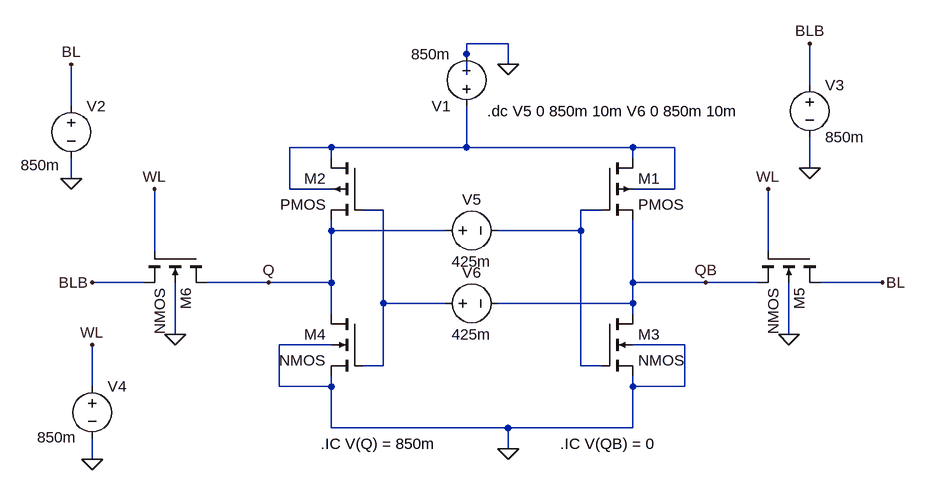
[diagram p0: schematic sram6t_snm.asc]
sram6t_snm.asc, the LTspice schematic file:
Version 4
SHEET 1 1636 4668
WIRE 288 -112 224 -112
WIRE 224 -96 224 -112
WIRE 288 -80 288 -112
WIRE 224 -64 224 -96
WIRE 752 -48 752 -112
WIRE -384 -16 -384 -80
WIRE 16 48 -48 48
WIRE 224 48 224 -16
WIRE 224 48 16 48
WIRE 480 48 224 48
WIRE 544 48 480 48
WIRE 16 64 16 48
WIRE 480 64 480 48
WIRE 752 80 752 32
WIRE -384 96 -384 64
WIRE -48 112 -48 48
WIRE 16 112 -48 112
WIRE 544 112 544 48
WIRE 544 112 480 112
WIRE 96 144 64 144
WIRE 432 144 400 144
WIRE 16 176 16 160
WIRE 192 176 16 176
WIRE 400 176 400 144
WIRE 400 176 272 176
WIRE -256 208 -256 112
WIRE 688 208 688 112
WIRE -272 256 -352 256
WIRE -80 256 -176 256
WIRE 16 256 16 176
WIRE 16 256 -80 256
WIRE 480 256 480 160
WIRE 592 256 480 256
WIRE 672 256 592 256
WIRE 864 256 768 256
WIRE 96 288 96 144
WIRE 192 288 96 288
WIRE 480 288 480 256
WIRE 480 288 272 288
WIRE 16 304 16 256
WIRE 480 304 480 288
WIRE -224 336 -224 256
WIRE 720 336 720 256
WIRE 16 352 -64 352
WIRE 560 352 480 352
WIRE 96 384 96 288
WIRE 96 384 64 384
WIRE 400 384 400 176
WIRE 432 384 400 384
WIRE -352 416 -352 352
WIRE -64 416 -64 352
WIRE 16 416 16 400
WIRE 16 416 -64 416
WIRE 480 416 480 400
WIRE 560 416 560 352
WIRE 560 416 480 416
WIRE 16 480 16 416
WIRE 288 480 16 480
WIRE 480 480 480 416
WIRE 480 480 288 480
WIRE 288 512 288 480
WIRE -352 528 -352 496
FLAG 288 512 0
FLAG -224 336 0
FLAG 720 336 0
FLAG -384 96 0
FLAG -352 528 0
FLAG 752 80 0
FLAG -80 256 Q
FLAG 592 256 QB
FLAG 688 112 WL
FLAG -256 112 WL
FLAG 864 256 BL
FLAG -352 256 BLB
FLAG -352 352 WL
FLAG -384 -80 BL
FLAG 752 -112 BLB
FLAG 288 -80 0
SYMBOL pmos4 432 64 R0
SYMATTR InstName M1
SYMATTR Value2 l=20n w=320n
SYMBOL pmos4 64 64 M0
SYMATTR InstName M2
SYMATTR Value2 l=20n w=320n
SYMBOL nmos4 432 304 R0
SYMATTR InstName M3
SYMATTR Value2 l=20n w=960n
SYMBOL nmos4 64 304 M0
SYMATTR InstName M4
SYMATTR Value2 l=20n w=960n
SYMBOL nmos4 768 208 R90
SYMATTR InstName M5
SYMATTR Value2 l=20n w=128n
SYMBOL nmos4 -176 208 R90
SYMATTR InstName M6
SYMATTR Value2 l=20n w=128n
SYMBOL voltage 224 0 R180
WINDOW 123 0 0 Left 0
WINDOW 39 0 0 Left 0
SYMATTR InstName V1
SYMATTR Value 850m
SYMBOL voltage -384 -32 R0
WINDOW 3 -17 107 Right 2
WINDOW 123 0 0 Left 0
WINDOW 39 0 0 Left 0
SYMATTR Value 850m
SYMATTR InstName V2
SYMBOL voltage 752 -64 R0
WINDOW 123 0 0 Left 0
WINDOW 39 0 0 Left 0
SYMATTR InstName V3
SYMATTR Value 850m
SYMBOL voltage -352 400 R0
WINDOW 3 -24 94 Right 2
WINDOW 123 0 0 Left 0
WINDOW 39 0 0 Left 0
SYMATTR Value 850m
SYMATTR InstName V4
SYMBOL voltage 176 176 R270
WINDOW 0 32 56 VTop 2
WINDOW 3 -32 56 VBottom 2
WINDOW 123 0 0 Left 0
WINDOW 39 0 0 Left 0
SYMATTR InstName V5
SYMATTR Value 425m
SYMBOL voltage 176 288 R270
WINDOW 0 32 56 VTop 2
WINDOW 3 -32 56 VBottom 2
WINDOW 123 0 0 Left 0
WINDOW 39 0 0 Left 0
SYMATTR InstName V6
SYMATTR Value 425m
TEXT 256 -8 Left 2 !.dc V5 0 850m 10m V6 0 850m 10m
TEXT 0 504 Left 2 !.IC V(Q) = 850m
TEXT 368 504 Left 2 !.IC V(QB) = 0

The netlist it stands for:
* sram6t_snm.asc
M1 N001 N003 QB N001 PMOS l=20n w=320n
M2 N001 N002 Q N001 PMOS l=20n w=320n
M3 QB N003 0 0 NMOS l=20n w=960n
M4 Q N002 0 0 NMOS l=20n w=960n
M5 BL WL QB 0 NMOS l=20n w=128n
M6 Q WL BLB 0 NMOS l=20n w=128n
V1 N001 0 850m
V2 BL 0 850m
V3 BLB 0 850m
V4 WL 0 850m
V5 Q N003 425m
V6 N002 QB 425m
.model NMOS NMOS
.model PMOS PMOS
.lib standard.mos
.dc V5 0 850m 10m V6 0 850m 10m
.IC V(Q) = 850m
.IC V(QB) = 0
.backanno
.end